# EAGLE design MainPCB (EAGLE 9.2.0)
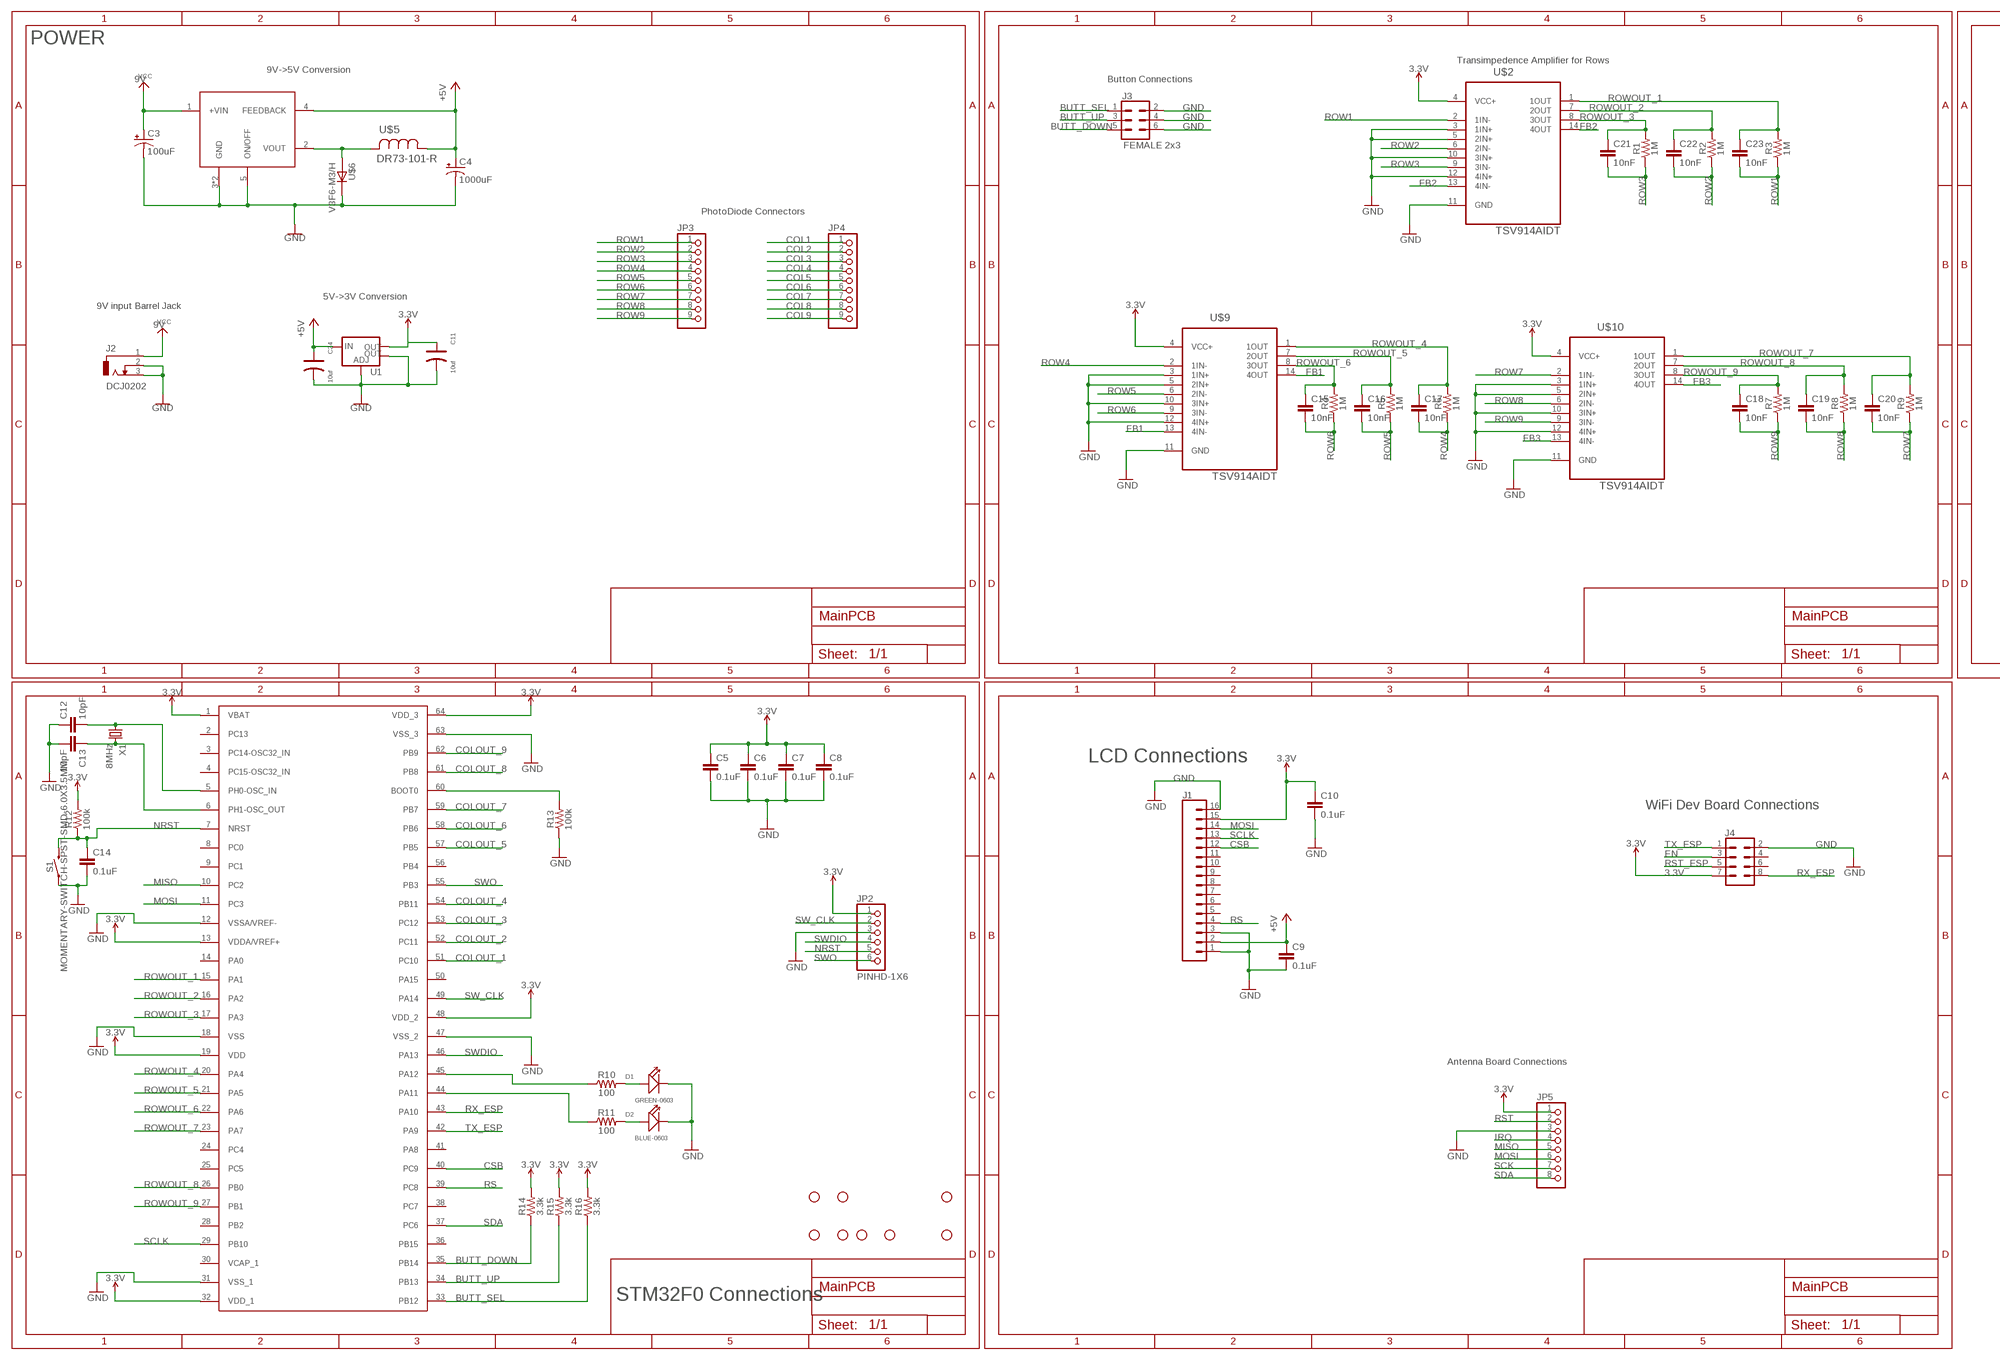
[diagram p0: schematic, sheet 1, part 1 of 2]
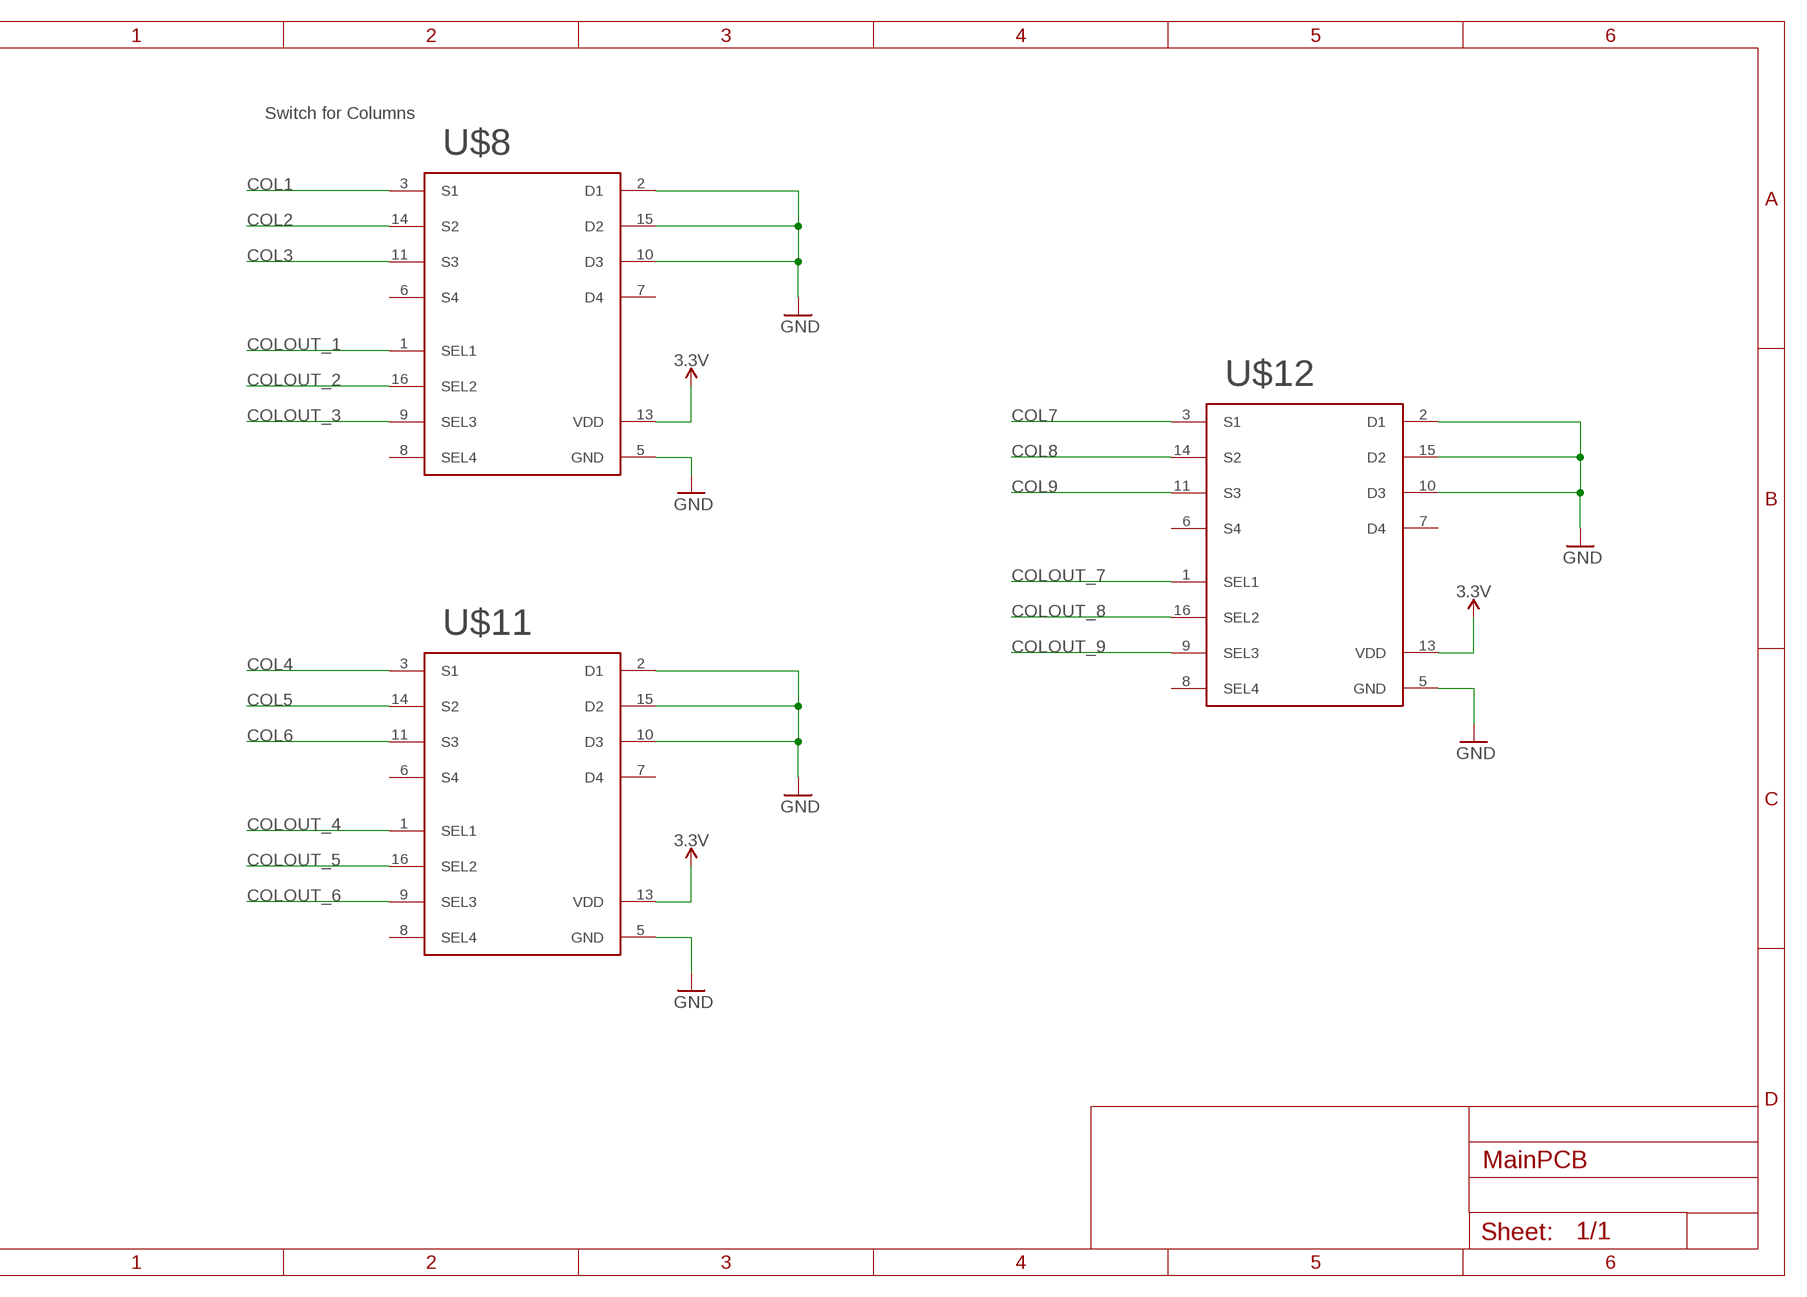
[diagram p1: schematic, sheet 1, part 2 of 2]

## Parts
C3  100uF  100UF-POLAR-25V-20%(ELEC)  [PANASONIC_D]
C4  1000uF  100UF-POLAR-25V-20%(ELEC)  [PANASONIC_D]
C5  0.1uF  0.1UF-0603-100V-10%  [0603]
C6  0.1uF  0.1UF-0603-100V-10%  [0603]
C7  0.1uF  0.1UF-0603-100V-10%  [0603]
C8  0.1uF  0.1UF-0603-100V-10%  [0603]
C9  0.1uF  0.1UF-0603-100V-10%  [0603]
C10  0.1uF  0.1UF-0603-100V-10%  [0603]
C11  10uf  TANTALUM-SMD-10UF-10V-10%(AVX-A)  [AVX-A]
C12  10pF  10UF-0805-10V-10%  [0805]
C13  10pF  10UF-0805-10V-10%  [0805]
C14  0.1uF  0.1UF-0603-25V-(+80/-20%)  [0603]
C15  10nF  10NF-0603-50V-10%  [0603]
C16  10nF  10NF-0603-50V-10%  [0603]
C17  10nF  10NF-0603-50V-10%  [0603]
C18  10nF  10NF-0603-50V-10%  [0603]
C19  10nF  10NF-0603-50V-10%  [0603]
C20  10nF  10NF-0603-50V-10%  [0603]
C21  10nF  10NF-0603-50V-10%  [0603]
C22  10nF  10NF-0603-50V-10%  [0603]
C23  10nF  10NF-0603-50V-10%  [0603]
C24  10uf  TANTALUM-SMD-10UF-10V-10%(AVX-A)  [AVX-A]
D1  GREEN-0603  SMD-LED-CLEAR-GREEN(0603)  [LED-0603]
D2  BLUE-0603  SMD-LED-CLEAR-BLUE(0603)  [LED-0603]
H2  STAND-OFF  [STAND-OFF]
H3  STAND-OFF  [STAND-OFF]
H4  STAND-OFF  [STAND-OFF]
H6  STAND-OFF  [STAND-OFF]
H7  STAND-OFF  [STAND-OFF]
H8  STAND-OFF  [STAND-OFF]
H9  STAND-OFF  [STAND-OFF]
H10  STAND-OFF  [STAND-OFF]
J1  CONN_161X16_NO_SILK  [1X16_NO_SILK]
J2  DCJ0202  [DCJ0202]
J3  FEMALE 2x3  CONN_03X2FEMALE  [2X3]
J4  CONN_04X2  [2X4]
JP2  PINHD-1X6  [1X06]
JP3  PINHD-1X9  [1X09]
JP4  PINHD-1X9  [1X09]
JP5  PINHD-1X8  [1X08]
R1  1M  1KOHM-0603-1/10W-1%  [0603]
R2  1M  1KOHM-0603-1/10W-1%  [0603]
R3  1M  1KOHM-0603-1/10W-1%  [0603]
R4  1M  1KOHM-0603-1/10W-1%  [0603]
R5  1M  1KOHM-0603-1/10W-1%  [0603]
R6  1M  1KOHM-0603-1/10W-1%  [0603]
R7  1M  1KOHM-0603-1/10W-1%  [0603]
R8  1M  1KOHM-0603-1/10W-1%  [0603]
R9  1M  1KOHM-0603-1/10W-1%  [0603]
R10  100  100OHM-0603-1/4W-5%  [0603]
R11  100  100OHM-0603-1/4W-5%  [0603]
R12  100k  100KOHM-0603-1/10W-1%  [0603]
R13  100k  100KOHM-0603-1/10W-1%  [0603]
R14  3.3k  3.3KOHM-0603-1/10W-1%  [0603]
R15  3.3k  3.3KOHM-0603-1/10W-1%  [0603]
R16  3.3k  3.3KOHM-0603-1/10W-1%  [0603]
S1  MOMENTARY-SWITCH-SPST-SMD-6.0X3.5MM  [TACTILE_SWITCH_SMD_6.0X3.5MM]
U1  V_REG_LM1117SOT223  [SOT223]
U$1  STM32F410R8T6  [TQFP64]
U$2  TSV914AIDT  [SOIC-14]
U$3  LM2576  [DDPAK/TO-263-5]
U$5  DR73-101-R  [INDUCTOR_NONSTANDARD]
U$6  V3F6-M3/H  [DO-219AB]
U$8  TMUX1112PWR  [16-TSSOP]
U$9  TSV914AIDT  [SOIC-14]
U$10  TSV914AIDT  [SOIC-14]
U$11  TMUX1112PWR  [16-TSSOP]
U$12  TMUX1112PWR  [16-TSSOP]
X1  8MHz  CRYSTALS-NOGND-HC49  [HC49]

## Nets
3.3V: C5.1 C6.1 C7.1 C8.1 C10.1 C11.+ J1.15 J4.7 JP2.1 JP5.1 R12.2 R14.2 R15.2 R16.2 U1.2(OUT) U$1.1(VBAT) U$1.13(VDDA/VREF+) U$1.19(VDD) U$1.32(VDD_1) U$1.48(VDD_2) U$1.64(VDD_3) U$2.4(VCC+) U$8.13(VDD) U$9.4(VCC+) U$10.4(VCC+) U$11.13(VDD) U$12.13(VDD)
9V: C3.+ J2.1 U$3.1(+VIN) ; supply symbol labelled VCC
+5V: C4.+ C9.1 C24.+ J1.2 U1.3(IN) U$3.4(FEEDBACK) U$5.1
BUTT_DOWN: J3.5 R14.1 U$1.35(PB14)
BUTT_SEL: J3.1 R16.1 U$1.33(PB12)
BUTT_UP: J3.3 R15.1 U$1.34(PB13)
COL1: JP4.1 U$8.3(S1)
COL2: JP4.2 U$8.14(S2)
COL3: JP4.3 U$8.11(S3)
COL4: JP4.4 U$11.3(S1)
COL5: JP4.5 U$11.14(S2)
COL6: JP4.6 U$11.11(S3)
COL7: JP4.7 U$12.3(S1)
COL8: JP4.8 U$12.14(S2)
COL9: JP4.9 U$12.11(S3)
COLOUT_1: U$1.51(PC10) U$8.1(SEL1)
COLOUT_2: U$1.52(PC11) U$8.16(SEL2)
COLOUT_3: U$1.53(PC12) U$8.9(SEL3)
COLOUT_4: U$1.54(PB11) U$11.1(SEL1)
COLOUT_5: U$1.57(PB5) U$11.16(SEL2)
COLOUT_6: U$1.58(PB6) U$11.9(SEL3)
COLOUT_7: U$1.59(PB7) U$12.1(SEL1)
COLOUT_8: U$1.61(PB8) U$12.16(SEL2)
COLOUT_9: U$1.62(PB9) U$12.9(SEL3)
CSB: J1.12 U$1.40(PC9)
EN: J4.3
FB1: U$9.13(4IN-) U$9.14(4OUT)
FB2: U$2.13(4IN-) U$2.14(4OUT)
FB3: U$10.13(4IN-) U$10.14(4OUT)
GND: C3.- C4.- C5.2 C6.2 C7.2 C8.2 C9.2 C10.2 C11.- C12.1 C13.2 C14.2 C24.- D1.- D2.- J1.1 J1.3 J1.16 J2.2 J2.3 J3.2 J3.4 J3.6 J4.2 JP2.3 JP5.3 R13.1 S1.1 U1.1(ADJ) U1.4(OUT) U$1.12(VSSA/VREF-) U$1.18(VSS) U$1.31(VSS_1) U$1.47(VSS_2) U$1.63(VSS_3) U$2.3(1IN+) U$2.5(2IN+) U$2.10(3IN+) U$2.11(GND) U$2.12(4IN+) U$3.3(GND) U$3.5(ON/OFF) U$3.6(GND) U$6.C U$8.2(D1) U$8.5(GND) U$8.10(D3) U$8.15(D2) U$9.3(1IN+) U$9.5(2IN+) U$9.10(3IN+) U$9.11(GND) U$9.12(4IN+) U$10.3(1IN+) U$10.5(2IN+) U$10.10(3IN+) U$10.11(GND) U$10.12(4IN+) U$11.2(D1) U$11.5(GND) U$11.10(D3) U$11.15(D2) U$12.2(D1) U$12.5(GND) U$12.10(D3) U$12.15(D2)
IRQ: JP5.4
MISO: JP5.5 U$1.10(PC2)
MOSI: J1.14 JP5.6 U$1.11(PC3)
N$1: C12.2 U$1.5(PH0-OSC_IN) X1.1
N$2: C13.1 U$1.6(PH1-OSC_OUT) X1.2
N$3: U$3.2(VOUT) U$5.2 U$6.A
N$4: R10.1 U$1.45(PA12)
N$5: D1.+ R10.2
N$6: R11.1 U$1.44(PA11)
N$7: D2.+ R11.2
N$9: R13.2 U$1.60(BOOT0)
NRST: C14.1 JP2.5 R12.1 S1.2 U$1.7(NRST)
ROW1: C23.2 JP3.1 R3.1 U$2.2(1IN-)
ROW2: C22.2 JP3.2 R2.1 U$2.6(2IN-)
ROW3: C21.2 JP3.3 R1.1 U$2.9(3IN-)
ROW4: C17.2 JP3.4 R6.1 U$9.2(1IN-)
ROW5: C16.2 JP3.5 R5.1 U$9.6(2IN-)
ROW6: C15.2 JP3.6 R4.1 U$9.9(3IN-)
ROW7: C20.2 JP3.7 R9.1 U$10.2(1IN-)
ROW8: C19.2 JP3.8 R8.1 U$10.6(2IN-)
ROW9: C18.2 JP3.9 R7.1 U$10.9(3IN-)
ROWOUT_1: C23.1 R3.2 U$1.15(PA1) U$2.1(1OUT)
ROWOUT_2: C22.1 R2.2 U$1.16(PA2) U$2.7(2OUT)
ROWOUT_3: C21.1 R1.2 U$1.17(PA3) U$2.8(3OUT)
ROWOUT_4: C17.1 R6.2 U$1.20(PA4) U$9.1(1OUT)
ROWOUT_5: C16.1 R5.2 U$1.21(PA5) U$9.7(2OUT)
ROWOUT_6: C15.1 R4.2 U$1.22(PA6) U$9.8(3OUT)
ROWOUT_7: C20.1 R9.2 U$1.23(PA7) U$10.1(1OUT)
ROWOUT_8: C19.1 R8.2 U$1.26(PB0) U$10.7(2OUT)
ROWOUT_9: C18.1 R7.2 U$1.27(PB1) U$10.8(3OUT)
RS: J1.4 U$1.39(PC8)
RST: JP5.2
RST_ESP: J4.5
RX_ESP: J4.8 U$1.43(PA10)
SCK: JP5.7
SCLK: J1.13 U$1.29(PB10)
SDA: JP5.8 U$1.37(PC6)
SW_CLK: JP2.2 U$1.49(PA14)
SWDIO: JP2.4 U$1.46(PA13)
SWO: JP2.6 U$1.55(PB3)
TX_ESP: J4.1 U$1.42(PA9)
Unconnected: J1.5 J1.6 J1.7 J1.8 J1.9 J1.10 J1.11 J4.4 J4.6 U$1.2(PC13) U$1.3(PC14-OSC32_IN) U$1.4(PC15-OSC32_IN) U$1.8(PC0) U$1.9(PC1) U$1.14(PA0) U$1.24(PC4) U$1.25(PC5) U$1.28(PB2) U$1.30(VCAP_1) U$1.36(PB15) U$1.38(PC7) U$1.41(PA8) U$1.50(PA15) U$1.56(PB4) U$8.6(S4) U$8.7(D4) U$8.8(SEL4) U$11.6(S4) U$11.7(D4) U$11.8(SEL4) U$12.6(S4) U$12.7(D4) U$12.8(SEL4)

## Notes on the sheet
- POWER
- Transimpedence Amplifier for Rows | Switch for Columns
- 9V->5V Conversion
- Button Connections
- PhotoDiode Connectors
- 5V->3V Conversion
- 9V input Barrel Jack
- LCD Connections
- WiFi Dev Board Connections
- Antenna Board Connections
- STM32F0 Connections

## Library data of the parts
C3 = SparkFun-Capacitors:100UF-POLAR: 100µF polarized capacitors A capacitor is a passive two-terminal electrical component used to store electrical energy temporarily in an electric field.; PROD_ID: CAP-12547
C4 = SparkFun-Capacitors:100UF-POLAR: 100µF polarized capacitors A capacitor is a passive two-terminal electrical component used to store electrical energy temporarily in an electric field.; PROD_ID: CAP-12547; VALUE: 100uF
C5-C10 = SparkFun-Capacitors:0.1UF: 0.1µF ceramic capacitors A capacitor is a passive two-terminal electrical component used to store electrical energy temporarily in an electric field.; PROD_ID: CAP-08390
C11 C24 = Seeed-Capacitor:TANTALUM-SMD-10UF-10V-10%(AVX-A): 302020011; MPN: TAJA106K010RNJ
C12 C13 = SparkFun-Capacitors:10UF: 10.0µF ceramic capacitors A capacitor is a passive two-terminal electrical component used to store electrical energy temporarily in an electric field.; PROD_ID: CAP-11330; VALUE: 10uF
C14 = SparkFun-Capacitors:0.1UF: 0.1µF ceramic capacitors A capacitor is a passive two-terminal electrical component used to store electrical energy temporarily in an electric field.; PROD_ID: CAP-00810
C15-C23 = SparkFun-Capacitors:10NF: 0.01uF/10nF/10,000pF ceramic capacitors A capacitor is a passive two-terminal electrical component used to store electrical energy temporarily in an electric field. CAP-09321; PROD_ID: CAP-00867
D1 = Seeed-LED:SMD-LED-CLEAR-GREEN(0603): 304090043; MPN: 19-217-G7C-AN1P2-3T
D2 = Seeed-LED:SMD-LED-CLEAR-BLUE(0603): 304090045; MPN: 19-217-BHC-ZL1M2RY-3T
H2-H4 H6-H10 = SparkFun-Hardware:STAND-OFF: Stand Off Drill holes for mechanically mounting via screws, standoffs, etc. Note: Use the keepout ring to avoid running the screw head into surrounding components. Variant Overviews STAND-OFF - Mechanical footprint for a #4 phillips button head screw. STAND-OFF-TIGHT - Mechanical footprint for a #4 phillips button head screw, Example SparkFun Products Screw - Phillips Head (1/4", 4-40, 10 pack) (PRT-10453) Screw - Phillips Head (1/2", 4-40, 10 pack) (PRT-10452) Screw - Phillips Head (3/4", 4-40, 10 pack) (PRT-10451) Screw - Phillips Head (1", 4-40, 10 pack) (PRT-10450)
J1 = SparkFun-Connectors:CONN_16: Multi connection point. Often used as Generic Header-pin footprint for 0.1 inch spaced/style header connections On any of the 0.1 inch spaced packages, you can populate with these: Break Away Headers - Straight (PRT-00116) Break Away Male Headers - Right Angle (PRT-00553) Female Headers (PRT-00115) Break Away Headers - Machine Pin (PRT-00117) Break Away Female Headers - Swiss Machine Pin (PRT-00743) For SCREWTERMINALS and SPRING TERMINALS visit here: Screw Terimnals on SparkFun.com (5mm/3.5mm/2.54mm spacing) This device is also useful as a general connection point to wire up your design to another part of your project. Our various solder wires solder well into these plated through hole pads. Hook-Up Wire - Assortment (Stranded, 22 AWG) (PRT-11375) Hook-Up Wire - Assortment (Solid Core, 22 AWG) (PRT-11367) View the entire wire category on our website here Special notes: Molex polarized connector foot print use with SKU : PRT-08231 with associated crimp pins and housings. 1MM SMD Version SKU: PRT-10208 NOTES ON THE VARIANTS LOCK and LOCK_LONGPADS... This footprint was designed to help hold the alignment of a through-hole component (i.e. 6-pin header) while soldering it into place. You may notice that each hole has been shifted either up or down by 0.005 of an inch from it's more standard position (which is a perfectly straight line). This slight alteration caused the pins (the squares in the middle) to touch the edges of the holes. Because they are alternating, it causes a "brace" to hold the component in place. 0.005 has proven to be the perfect amount of "off-center" position when using our standard breakaway headers. Although looks a little odd when you look at the bare footprint, once you have a header in there, the alteration is very hard to notice. Also,if you push a header all the way into place, it is covered up entirely on the bottom side.
J2 = con-jack:DCJ0202: DC POWER JACK Source: DCJ0202.pdf; OC_FARNELL: unknown; OC_NEWARK: unknown
J3 = SparkFun-Connectors:CONN_03X2: Multi connection point. Often used as Generic Header-pin footprint for 0.1 inch spaced/style header connections You can populate with any combo of single row headers, but if you'd like an exact match, check these: Header - 2x3 (Male, 0.1") (PRT-12807) Header - 2x3 (Female, 0.1") (PRT-13010) 2x3 Pin Shrouded Header (PRT-10877) On any of the 0.1 inch spaced packages, you can populate with these: Break Away Headers - Straight (PRT-00116) Break Away Male Headers - Right Angle (PRT-00553) Female Headers (PRT-00115) Break Away Headers - Machine Pin (PRT-00117) Break Away Female Headers - Swiss Machine Pin (PRT-00743) Special note: the shrouded connector mates well with our 3x2 ribbon cables: Ribbon Crimp Connector - 6-pin (2x3, Female) (PRT-10651) Ribbon Cable - 6 wire (15ft) (PRT-10646); PROD_ID: CONN-11566
J4 = SparkFun-Connectors:CONN_04X2: Multi connection point. Often used as Generic Header-pin footprint for 0.1 inch spaced/style header connections On any of the 0.1 inch spaced packages, you can populate with these: Break Away Headers - Straight (PRT-00116) Break Away Male Headers - Right Angle (PRT-00553) Female Headers (PRT-00115) Break Away Headers - Machine Pin (PRT-00117) Break Away Female Headers - Swiss Machine Pin (PRT-00743)
JP2 = audio amplifier example:PINHD-1X6: PIN HEADER
JP3 JP4 = pinhead:PINHD-1X9: PIN HEADER
JP5 = pinhead:PINHD-1X8: PIN HEADER
R1-R9 = SparkFun-Resistors:1KOHM: 1kΩ resistor A resistor is a passive two-terminal electrical component that implements electrical resistance as a circuit element. Resistors act to reduce current flow, and, at the same time, act to lower voltage levels within circuits. - Wikipedia; PROD_ID: RES-07856; VALUE: 1k
R10 R11 = SparkFun-Resistors:100OHM: 100Ω resistor A resistor is a passive two-terminal electrical component that implements electrical resistance as a circuit element. Resistors act to reduce current flow, and, at the same time, act to lower voltage levels within circuits. - Wikipedia; PROD_ID: RES-12438
R12 R13 = SparkFun-Resistors:100KOHM: 100kΩ resistor A resistor is a passive two-terminal electrical component that implements electrical resistance as a circuit element. Resistors act to reduce current flow, and, at the same time, act to lower voltage levels within circuits. - Wikipedia; PROD_ID: RES-07828
R14-R16 = SparkFun-Resistors:3.3KOHM: 3.3kΩ resistor A resistor is a passive two-terminal electrical component that implements electrical resistance as a circuit element. Resistors act to reduce current flow, and, at the same time, act to lower voltage levels within circuits. - Wikipedia; PROD_ID: RES-07851
S1 = SparkFun-Switches:MOMENTARY-SWITCH-SPST: Momentary Switch (Pushbutton) - SPST Normally-open (NO) SPST momentary switches (buttons, pushbuttons). Variants PTH-12MM - 12mm square, through-hole Momentary Pushbutton Switch - 12mm Square (COM-09190) PTH-6.0MM, PTH-6.0MM-KIT - 6.0mm square, through-hole Mini Pushbutton Switch (COM-00097) KIT package intended for soldering kit's - only one side of pads' copper is exposed. PTH-RIGHT-ANGLE-KIT - Right-angle, through-hole Right Angle Tactile Button - Used on SparkFun BigTime Watch Kit SMD-12MM - 12mm square, surface-mount Tactile Button - SMD (12mm) (COM-12993) Used on SparkFun PicoBoard SMD-4.5MM - 4.5mm Square Trackball Switch Used on SparkFun Blackberry Trackballer Breakout SMD-4.6MMX2.8MM - 4.60mm x 2.80mm, surface mount Used on SparkFun SAMD21 Mini Breakout SMD-5.2MM, SMD-5.2-REDUNDANT - 5.2mm square, surface-mount Mini Pushbutton Switch - SMD (COM-08720) Used on Arduino Pro Mini REDUNDANT package connects both switch circuits together SMD-6.0X3.5MM - 6.0 x 3.5mm, surface mount Momentary Reset Switch SMD (COM-08229) SMD-6.2MM-TALL - 6.2mm square, surface mount Tactile Button - SMD (6mm) Used on SparkFun Digital Sandbox SMD-RIGHT-ANGLE - Right-angle, surface mount Used on SparkFun Block for Intel® Edison - Arduino; PROD_ID: SWCH-00815; SF_SKU: COM-08229
U1 = SparkFun-IC-Power:V_REG_LM1117: Voltage Regulator LM1117 Standard adjustable voltage regulator but in SMD form. Spark Fun Electronics SKU : COM-00595; PROD_ID: VREG-08170
U$1 = SeniorDesignParts:STM32F410R8T6
U$2 U$9 U$10 = SeniorDesignParts:TSV914AIDT
U$3 = SeniorDesignParts:LM2576
U$5 = SeniorDesignParts:DR73-101-R
U$6 = SeniorDesignParts:V3F6-M3/H
U$8 U$11 U$12 = SeniorDesignParts:TMUX1112PWR
X1 = IQD-Frequency-Products:CRYSTALS-NOGND: CRYSTALS CAN NOT GROUNDED

## Board
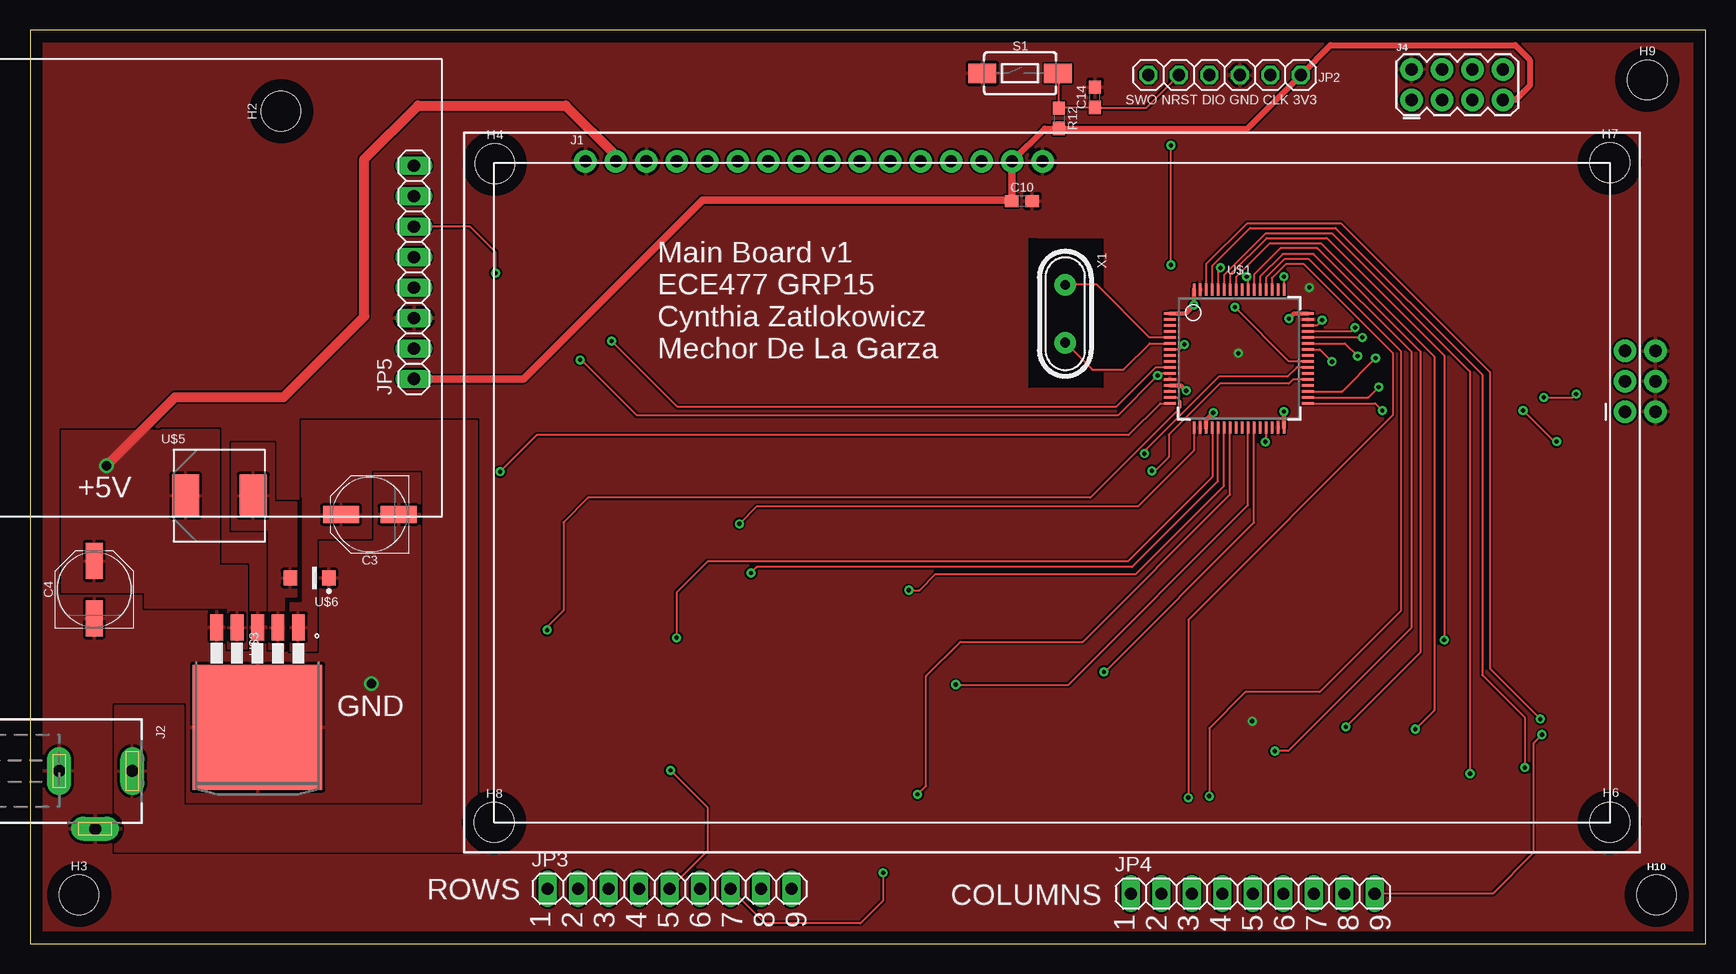
[diagram p2: board, top side]
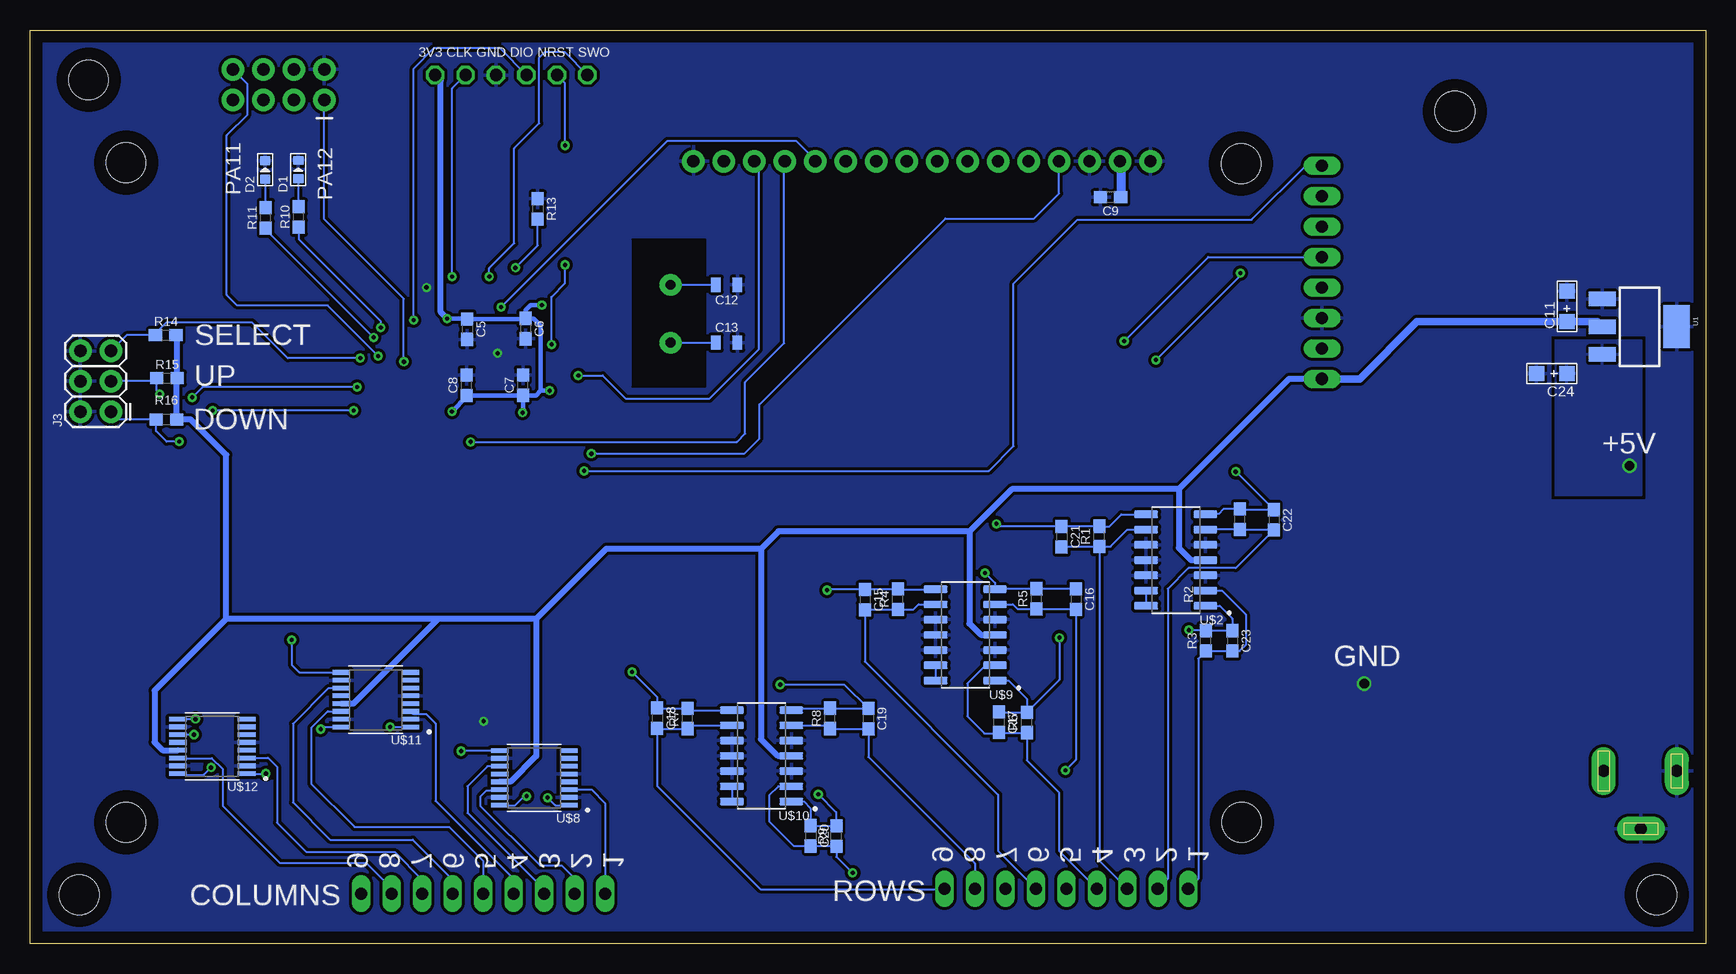
[diagram p3: board, bottom side, seen from below]

Size 139.7 x 76.2 mm. Coordinates in mm from the lower left corner, seen from the top.
Outline: 0,0 139.7,0 139.7,76.2 0,76.2 0,0
Copper layers (1*16): Top 0.035mm / dielectric 1.5mm / Bottom 0.035mm
Design rules "default": minimum track width 6mil, minimum drill 0.35mm, track to track 6mil, track to pad 6mil, pad to pad 6mil, via to via 6mil, smd to smd 6mil, copper to edge 40mil, drill to drill 6mil, minimum pad ring 10mil, minimum via ring 8mil, stop-mask expansion 4mil, vias tented up to drill 0mil, thermal gap 10mil

### Footprints (pad centres in the part's own frame; a part is rotated, then mirrored left to right if it is on the bottom)
PANASONIC_D = smd 3 x 1.4: + 2.4,0; - -2.4,0
0603 = smd 1.1 x 1: 1 -0.85,0; 2 0.85,0
AVX-A = smd 1.27 x 1.27: + -1.27,0; - 1.27,0
0805 = smd 0.8 x 1.2: 1 -0.9,0; 2 0.9,0
LED-0603 = smd 0.762 x 0.889: + -0.762,0; - 0.762,0
STAND-OFF = hole 3.302: 0,0
1X16_NO_SILK = drill 1.016 pad 1.88: 1 0,0; 2 2.54,0; 3 5.08,0; 4 7.62,0; 5 10.16,0; 6 12.7,0; 7 15.24,0; 8 17.78,0; 9 20.32,0; 10 22.86,0; 11 25.4,0; 12 27.94,0; 13 30.48,0; 14 33.02,0; 15 35.56,0; 16 38.1,0
DCJ0202 = drill 1 pad 2 long: 1 0,3.1; 2 4.8,0; 3 0,-3
2X3 = drill 1.016 pad 1.88: 1 0,0; 2 0,2.54; 3 2.54,0; 4 2.54,2.54; 5 5.08,0; 6 5.08,2.54
2X4 = drill 1.016 pad 1.88: 1 -3.81,-1.27; 2 -3.81,1.27; 3 -1.27,-1.27; 4 -1.27,1.27; 5 1.27,-1.27; 6 1.27,1.27; 7 3.81,-1.27; 8 3.81,1.27
1X06 = drill 1.016 octagon: 1 -6.35,0; 2 -3.81,0; 3 -1.27,0; 4 1.27,0; 5 3.81,0; 6 6.35,0
1X09 = drill 1.016 long: 1 -10.16,0; 2 -7.62,0; 3 -5.08,0; 4 -2.54,0; 5 0,0; 6 2.54,0; 7 5.08,0; 8 7.62,0; 9 10.16,0
1X08 = drill 1.016 long: 1 -8.89,0; 2 -6.35,0; 3 -3.81,0; 4 -1.27,0; 5 1.27,0; 6 3.81,0; 7 6.35,0; 8 8.89,0
TACTILE_SWITCH_SMD_6.0X3.5MM = smd 2.3 x 1.6: 1 -3.15,0; 2 3.15,0
SOT223 = smd 1.219 x 2.235: 1 -2.311,-3.099; 2 0,-3.099; 3 2.311,-3.099 | smd 3.6 x 2.2: 4 0,3.099
TQFP64 = smd 0.22 x 1: 1 -3.75,-5.75; 2 -3.25,-5.75; 3 -2.75,-5.75; 4 -2.25,-5.75; 5 -1.75,-5.75; 6 -1.25,-5.75; 7 -0.75,-5.75; 8 -0.25,-5.75; 9 0.25,-5.75; 10 0.75,-5.75; 11 1.25,-5.75; 12 1.75,-5.75; 13 2.25,-5.75; 14 2.75,-5.75; 15 3.25,-5.75; 16 3.75,-5.75; 33 3.75,5.75; 34 3.25,5.75; 35 2.75,5.75; 36 2.25,5.75; 37 1.75,5.75; 38 1.25,5.75; 39 0.75,5.75; 40 0.25,5.75; 41 -0.25,5.75; 42 -0.75,5.75; 43 -1.25,5.75; 44 -1.75,5.75; 45 -2.25,5.75; 46 -2.75,5.75; 47 -3.25,5.75; 48 -3.75,5.75 | smd 1 x 0.22: 17 5.75,-3.75; 18 5.75,-3.25; 19 5.75,-2.75; 20 5.75,-2.25; 21 5.75,-1.75; 22 5.75,-1.25; 23 5.75,-0.75; 24 5.75,-0.25; 25 5.75,0.25; 26 5.75,0.75; 27 5.75,1.25; 28 5.75,1.75; 29 5.75,2.25; 30 5.75,2.75; 31 5.75,3.25; 32 5.75,3.75; 49 -5.75,3.75; 50 -5.75,3.25; 51 -5.75,2.75; 52 -5.75,2.25; 53 -5.75,1.75; 54 -5.75,1.25; 55 -5.75,0.75; 56 -5.75,0.25; 57 -5.75,-0.25; 58 -5.75,-0.75; 59 -5.75,-1.25; 60 -5.75,-1.75; 61 -5.75,-2.25; 62 -5.75,-2.75; 63 -5.75,-3.25; 64 -5.75,-3.75
SOIC-14 = smd 1.97 x 0.6: 1 -2.475,3.81; 2 -2.475,2.54; 3 -2.475,1.27; 4 -2.475,0; 5 -2.475,-1.27; 6 -2.475,-2.54; 7 -2.475,-3.81; 8 2.475,-3.81; 9 2.475,-2.54; 10 2.475,-1.27; 11 2.475,0; 12 2.475,1.27; 13 2.475,2.54; 14 2.475,3.81
DDPAK/TO-263-5 = smd 2.159 x 1.067: 1 0.559,8.484; 2 0.559,6.782; 3 0.559,5.08; 4 0.559,3.378; 5 0.559,1.676 | smd 10.41 x 10.8: 6 8.89,5.08
INDUCTOR_NONSTANDARD = smd 2.261 x 3.505: 1 -2.819,0; 2 2.819,0
DO-219AB = smd 1.12 x 1.22: A 1.6,0; C -1.6,0
16-TSSOP = smd 1.57 x 0.41: 1 -2.87,2.275; 2 -2.87,1.625; 3 -2.87,0.975; 4 -2.87,0.325; 5 -2.87,-0.325; 6 -2.87,-0.975; 7 -2.87,-1.625; 8 -2.87,-2.275; 9 2.87,-2.275; 10 2.87,-1.625; 11 2.87,-0.975; 12 2.87,-0.325; 13 2.87,0.325; 14 2.87,0.975; 15 2.87,1.625; 16 2.87,2.275
HC49 = drill 0.813 pad 1.8: 1 -2.413,0; 2 2.413,0

### Placement (x,y rotation side)
C3  28.32,35.81 180 top
C4  5.35,29.55 90 top
C5  103.25,51.25 270 bottom
C6  98.4,51.3 270 bottom
C7  98.6,46.59 90 bottom
C8  103.3,46.58 90 bottom
C9  49.63,62.25 180 bottom
C10  82.69,61.94 0 top
C11  11.58,53.16 90 bottom
C12  81.63,54.96 180 bottom
C13  81.63,50.14 0 bottom
C14  88.78,70.59 90 top
C15  70.11,28.69 270 bottom
C16  52.52,28.75 270 bottom
C17  58.95,18.5 270 bottom
C18  87.41,18.82 270 bottom
C19  69.82,18.78 270 bottom
C20  74.63,9.01 270 bottom
C21  53.71,33.95 270 bottom
C22  36.03,35.35 270 bottom
C23  39.48,25.27 270 bottom
C24  12.85,47.55 180 bottom
D1  117.34,64.56 90 bottom
D2  120.1,64.54 90 bottom
H2  20.92,69.42 90 top
H3  4.09,4.09 0 top
H4  38.74,65.05 0 top
H6  131.7,10.13 0 top
H7  131.7,65.13 0 top
H8  38.7,10.13 0 top
H9  134.82,72.03 0 top
H10  135.59,4.09 0 top
J1  46.3,65.25 0 top
J2  5.42,14.41 270 top
J3  132.96,44.37 90 bottom
J4  118.97,71.64 0 top
JP2  99.59,72.45 180 top
JP3  53.31,4.6 0 top
JP4  101.93,4.19 0 top
JP5  32,56 90 top
R1  50.57,33.98 90 bottom
R2  38.84,35.41 90 bottom
R3  41.69,25.27 90 bottom
R4  67.35,28.74 90 bottom
R5  55.79,28.77 90 bottom
R6  56.61,18.46 90 bottom
R7  84.88,18.8 90 bottom
R8  73,18.8 90 bottom
R9  72.48,8.99 90 bottom
R10  117.29,60.61 90 bottom
R11  120.04,60.54 90 bottom
R12  85.77,68.84 270 top
R13  97.38,61.28 270 bottom
R14  128.38,50.75 0 bottom
R15  128.28,47.17 0 bottom
R16  128.33,43.73 0 bottom
S1  82.54,72.58 0 top
U1  5.54,51.46 270 bottom
U$1  100.78,48.82 270 top
U$2  44.19,32 180 bottom
U$3  13.89,26.95 270 top
U$5  15.78,37.38 0 top
U$6  23.3,30.51 180 top
U$8  97.67,13.84 180 bottom
U$9  61.73,25.77 180 bottom
U$10  78.71,15.68 180 bottom
U$11  110.87,20.36 180 bottom
U$12  124.51,16.48 180 bottom
X1  86.3,52.54 270 top

### Tracks (layer width: path | path; a pad name or v marks a point on that pad's centre or on a via)
3.3V  (via drill 0.35)
  Top 0.381: v98.63,44.29 98.02,43.68 U$1.19 | v104.53,44.39 U$1.32 | U$1.48 105.36,52.57 v104.93,52.14 | U$1.64 v97.03,53.26 96.35,52.57 U$1.1 | v96.38,46.12 95.94,46.57 U$1.13
  Top 0.508: J1.15 84.6,67.99 R12.2 101.47,67.99 JP2.1 108.42,74.93 123.8,74.93 125.02,73.71 125.02,71.55 123.84,70.37 J4.7
  Top 0.61: JP5.1 41.14,47.11 56.06,62.03 81.75,62.03 | C10.1 81.84,65.23
  Top 0.813: 81.75,62.03 C10.1 | 81.84,65.23 J1.15
  Bottom 0.381: C6.1 97.73,52.15 97.13,51.56 97.13,46.12 | C7.1 97.52,45.74 97.13,46.12 | C7.1 C8.1 103.3,45.63 104.53,44.4 v104.53,44.39 | C7.1 98.6,44.33 v98.63,44.29 | v97.03,53.26 97.97,53.26 98.4,52.83 C6.1 | C6.1 98.45,52.1 C5.1 103.29,52.14 v104.93,52.14 | 97.13,46.12 v96.39,46.12 v96.38,46.12
  Bottom 0.508: v104.93,52.14 105.47,52.67 105.47,71.98 JP2.1 | JP5.1 34.75,47.11 43.94,37.92 | 43.94,37.92 43.94,33.02 42.92,32 U$2.4 | 43.94,37.92 57.86,37.92 61.39,34.39 | 61.39,34.39 61.39,26.72 60.44,25.77 U$9.4 | 61.39,34.39 77.32,34.39 78.77,32.94 | 78.77,32.94 78.77,17.07 77.38,15.68 U$10.4 | 78.77,32.94 91.67,32.94 97.51,27.1 | 97.51,27.1 97.51,15.66 99.65,13.52 U$8.13 | U$11.13 113.72,20.02 112.75,20.02 105.66,27.1 | 97.51,27.1 105.66,27.1 | 105.66,27.1 123.34,27.1 | U$12.13 128.65,16.15 129.31,16.82 129.31,21.13 123.34,27.1 | 123.34,27.1 123.34,40.77 126.31,43.73 R16.2 127.48,47.12 R15.2 127.43,50.65 R14.2
  Bottom 0.61: U1.2 9.07,51.89 C11.+ 24.08,51.89 28.86,47.11 JP5.1
9V
  pour Top (isolate 0.406, rank 2): 7.06,19.84 7.06,7.7 37.29,7.7 37.29,43.58 22.63,43.58 22.63,28.49 21.5,28.49 21.5,24.49 23.88,24.49 23.88,33.83 28.42,33.83 28.42,39.54 32.76,39.54 32.76,11.5 12.8,11.5 12.8,19.84
+5V  (via drill 0.8)
  Top 0.813: v6.38,39.88 12.09,45.59 21.13,45.59 27.86,52.32 27.86,65.43 32.33,69.9 44.65,69.9 48.84,65.71 J1.2
  Bottom 0.762: C9.1 48.78,65.19 J1.2
  pour Top: 11.02,42.9 15.72,42.9 15.72,31.55 18.06,31.55 18.06,24.59 16.54,24.59 16.54,28.02 9.6,28.02 9.6,29.29 2.69,29.29 2.69,42.82 11.02,42.82
  pour Bottom: 6.38,50.32 12.57,50.32 12.57,45.36 12.57,37.41 5.36,37.41 5.36,50.32
BUTT_DOWN  (via drill 0.35)
  Top 0.152: U$1.35 109.39,46.07 v112.17,48.84
  Bottom 0.152: v112.17,48.84 118.21,48.84 121.18,51.82 128.34,51.82 129.23,50.93 R14.1 131.66,50.75 J3.5
BUTT_SEL  (via drill 0.35)
  Top 0.152: U$1.33 112.13,45.07 v112.72,44.48 | v124.46,44.48 127.05,41.88 v127.25,41.88
  Bottom 0.152: J3.1 132.32,43.73 R16.1 129.18,42.75 128.32,41.88 v127.25,41.88 | v112.72,44.48 v124.46,44.48
BUTT_UP  (via drill 0.35)
  Top 0.152: U$1.34 111.56,45.57 v112.42,46.43 | v126.19,45.57 128.6,45.57 v128.88,45.85
  Bottom 0.152: J3.3 129.39,46.91 R15.1 129.13,46.1 v128.88,45.85 | v112.42,46.43 125.32,46.43 v126.19,45.57
COL1
  Bottom 0.152: U$8.3 92.9,12.87 91.77,11.73 JP4.1
COL2
  Bottom 0.152: U$8.14 100.61,12.79 101.64,12.79 102.16,12.27 102.16,11.53 97.18,6.55 95.38,6.55 94.31,5.49 JP4.2
COL3
  Bottom 0.152: U$8.11 101.56,14.82 103.23,13.16 103.23,10.92 96.85,4.55 JP4.3
COL4
  Bottom 0.152: U$11.3 107.79,19.17 106.7,19.17 105.89,18.37 105.89,11.91 99.39,5.41 JP4.4
COL5
  Bottom 0.152: U$11.14 113.76,19.4 114.87,19.4 116.26,18.02 116.26,13.36 112.65,9.75 104.75,9.75 101.93,6.93 JP4.5
COL6
  Bottom 0.152: U$11.11 114.81,21.34 117.78,18.36 117.78,11.79 114.68,8.69 107.8,8.69 104.47,5.36 JP4.6
COL7
  Bottom 0.152: U$12.3 121.62,15.51 119.85,15.51 119.1,14.77 119.1,10.11 116.66,7.67 109.32,7.67 107.01,5.36 JP4.7
COL8
  Bottom 0.152: JP4.8 109.55,4.65 111.68,6.78 118.89,6.78 118.89,6.76 123.62,11.5 123.62,14.58 124.54,15.49 127.37,15.49 U$12.14
COL9  (via drill 0.35)
  Top 0.152: v126.03,17.45 125.32,16.74 125.32,7.59 121.92,4.19 JP4.9
  Bottom 0.152: U$12.11 v126.04,17.45 v126.03,17.45
COLOUT_1  (via drill 0.35)
  Top 0.152: U$1.51 103.53,55.51 103.52,55.52 104.69,56.69 106.19,56.69 113.6,49.27 113.6,44.08 96.55,27.03 v96.55,12.19
  Bottom 0.152: U$8.1 95.92,11.57 v96.55,12.19
COLOUT_2  (via drill 0.35)
  Top 0.152: U$1.52 103.03,55.56 104.56,57.1 106.61,57.1 114.29,49.41 114.29,27.78 107.52,21.01 101.32,21.01 98.3,17.98 v98.3,12.32
  Bottom 0.152: U$8.16 99.25,11.57 98.5,12.32 v98.3,12.32
COLOUT_3  (via drill 0.35)
  Top 0.152: U$1.53 102.53,55.62 104.43,57.53 107,57.53 115.13,49.4 115.13,26.33 104.88,16.08 v103.76,16.08
  Bottom 0.152: v103.76,16.08 103.72,16.12 U$8.9
COLOUT_4  (via drill 0.35)
  Top 0.152: U$1.54 102.03,55.79 102.02,55.8 104.23,58.01 107.31,58.01 115.92,49.4 115.92,24.32 v109.68,18.09
  Bottom 0.152: U$11.1 v109.68,18.09
COLOUT_5  (via drill 0.35)
  Top 0.152: U$1.57 100.53,55.59 100.52,55.6 103.34,58.42 107.61,58.42 117.04,48.98 117.04,19.48 v115.47,17.91
  Bottom 0.152: v115.47,17.91 115.29,18.09 U$11.16
COLOUT_6  (via drill 0.35)
  Top 0.152: U$1.58 100.03,55.79 103.09,58.85 108.09,58.85 117.88,49.06 v117.88,25.35
  Bottom 0.152: v117.88,25.35 117.88,23.27 117.25,22.64 U$11.9
COLOUT_7  (via drill 0.35)
  Top 0.152: U$1.59 99.53,55.77 102.99,59.23 108.55,59.23 120.04,47.74 v120.04,14.2
  Bottom 0.152: U$12.1 v120.04,14.2
COLOUT_8  (via drill 0.35)
  Top 0.152: U$1.61 98.53,56.52 101.69,59.69 108.83,59.69 121.06,47.46 121.06,22.43 124.61,18.87 v124.61,14.71
  Bottom 0.152: v124.61,14.71 125.22,14.1 127.27,14.1 U$12.16
COLOUT_9  (via drill 0.35)
  Top 0.152: v125.91,18.75 121.69,22.96 121.69,47.69 109.29,60.09 101.46,60.09 98.03,56.66 U$1.62
  Bottom 0.152: U$12.9 v125.91,18.75
CSB  (via drill 0.35)
  Top 0.152: U$1.40 104.95,48.57 v100.43,53.09
  Bottom 0.152: v100.43,53.09 86.56,66.95 75.84,66.95 74.24,65.35 J1.12
FB1
  Bottom 0.152: U$9.13 U$9.14
FB2
  Bottom 0.152: U$2.13 U$2.14
FB3
  Bottom 0.152: U$10.13 U$10.14
GND  (via drill 0.35, 0.8)
  other vias: 100.73,49.25 28.47,21.69 101.88,18.57 106.65,54.74
  pour Top (isolate 0.127, rank 3): 0.23,75.72 139.45,75.72 139.45,0.18 0.23,0.18
  pour Bottom (isolate 0.254, rank 2): 0.3,76.15 138.76,76.15 138.76,-1.24 0.3,-1.24
  cutout Top: 83.83,58.75 89.4,58.75 89.4,46.43 83.3,46.43 83.3,58.8 83.83,58.8
  cutout Bottom: 83.4,58.72 89.47,58.72 89.47,46.45 83.4,46.45
MISO  (via drill 0.35)
  Top 0.152: U$1.10 93.82,48.07 90.53,44.78 53.98,44.78 v48.49,50.27
  Bottom 0.152: v48.49,50.27 41.48,57.27 JP5.5
MOSI  (via drill 0.35)
  Top 0.152: U$1.11 94.18,47.57 v94,47.39 90.68,44.07 50.62,44.07 46,48.69 v45.85,48.69 | v38.81,55.93 38.81,57.68 36.69,59.81 JP5.6
  Bottom 0.152: v94,47.39 91.97,47.39 90.02,45.44 83.08,45.44 78.97,49.56 78.97,64.9 J1.14 | v45.85,48.69 38.81,55.73 v38.81,55.93
N$1
  Top 0.152: U$1.5 93.33,50.57 88.95,54.95 X1.1
  Bottom 0.152: X1.1 C12.2
N$2
  Top 0.152: U$1.6 93.35,50.07 91.15,47.88 88.55,47.88 X1.2
  Bottom 0.152: X1.2 82.53,50.13 C13.1
N$3
  pour Top (isolate 0.406): 20.29,41.78 20.29,36.83 22.17,36.83 22.17,28.93 21.13,28.93 21.13,24.54 19.94,24.54 19.94,34.49 16.87,34.49 16.87,41.78
N$4  (via drill 0.35)
  Top 0.152: v110.45,51.38 110.14,51.07 U$1.45
  Bottom 0.152: R10.1 117.29,58.77 110.45,51.93 v110.45,51.38
N$5
  Bottom 0.152: R10.2 117.29,63.75 D1.+
N$6  (via drill 0.35)
  Top 0.152: v111.06,50.57 U$1.44
  Bottom 0.152: v111.06,50.57 120.04,59.54 R11.1
N$7
  Bottom 0.152: D2.+ 120.04,63.71 R11.2
N$9  (via drill 0.35)
  Top 0.152: U$1.60 99.04,56.17 v99.24,56.37 v99.24,56.38
  Bottom 0.152: v99.24,56.38 97.38,58.23 R13.2
NRST  (via drill 0.35)
  Top 0.152: U$1.7 95.82,49.57 v96.23,49.98 | JP2.5 93.02,69.7 88.82,69.7 C14.1 85.82,69.74 R12.1 85.77,72.51 S1.2 | v95.1,56.62 v95.1,66.57
  Bottom 0.152: v96.23,49.98 96.23,53.95 95.1,55.08 v95.1,56.62 | v95.1,66.57 95.1,71.77 JP2.5
ROW1
  Bottom 0.152: JP3.1 42.32,5.43 42.32,23.78 R3.1 C23.2 38.88,24.42 38.35,24.94 38.35,27.46 40.35,29.46 U$2.2
ROW2
  Bottom 0.152: JP3.2 44.86,5.44 44.86,29.62 43.13,31.34 39.19,31.34 C22.2 36.09,34.56 R2.1 38.86,34.54 U$2.6
ROW3
  Bottom 0.152: U$2.9 48.21,34.54 49.63,33.12 R1.1 | R1.1 53.68,33.13 C21.2 | JP3.3 50.57,6.93 R1.1
ROW4
  Bottom 0.152: JP3.4 53.92,7.75 53.92,12.62 56.61,15.31 R6.1 58.91,17.61 C17.2 58.85,17.55 60.15,17.55 61.57,18.97 61.57,21.72 60.06,23.23 U$9.2
ROW5  (via drill 0.35)
  Top 0.152: v53.39,14.48 56.46,11.4 56.46,7.75 JP3.5
  Bottom 0.152: U$9.6 57.77,28.3 57.39,27.92 R5.1 52.54,27.92 C16.2 52.52,15.35 v53.39,14.48
ROW6
  Bottom 0.152: U$9.9 65.62,28.3 66.04,27.89 R4.1 70.06,27.89 C15.2 70.11,23.55 59,12.45 59,7.75 JP3.6
ROW7  (via drill 0.35)
  Top 0.152: v71.12,5.92 71.12,3.61 69.22,1.7 61.29,1.7 JP3.7
  Bottom 0.152: U$10.2 77.31,13.14 78.08,12.37 78.08,10.24 76,8.15 75.99,8.16 C20.2 72.51,8.16 R9.1 72.48,7.25 71.14,5.92 v71.12,5.92
ROW8
  Bottom 0.152: U$10.6 73.27,18.22 R8.1 72.98,17.93 C19.2 69.83,15.6 60.94,6.71 JP3.8
ROW9
  Bottom 0.152: U$10.9 84.6,18.22 R7.1 87.39,17.95 C18.2 87.41,13.17 78.82,4.57 63.5,4.57 JP3.9
ROWOUT_1  (via drill 0.35)
  Top 0.152: U$1.15 95.59,45.57 95.9,45.26 95.9,44.73 88.39,37.21 46.53,37.21 44.48,35.15 44.48,27.81 43.1,26.44 v43.1,26.16
  Bottom 0.152: U$2.1 40.53,28.19 39.45,27.1 39.48,27.07 C23.1 R3.2 41.69,26.16 v43.1,26.16
ROWOUT_2  (via drill 0.35)
  Top 0.152: v39.19,39.37 42.24,42.42 91.57,42.42 94.22,45.07 U$1.16
  Bottom 0.152: U$2.7 41.67,35.86 40.61,35.86 40.21,36.27 R2.2 38.77,36.2 C22.1 v39.19,39.37
ROWOUT_3  (via drill 0.35)
  Top 0.152: v59.13,35.03 60.58,36.47 92.35,36.47 97,41.12 97,43.05 U$1.17
  Bottom 0.152: U$2.8 48.72,35.81 49.71,34.82 R1.2 53.68,34.83 C21.1 58.91,34.8 v59.13,35.03
ROWOUT_4  (via drill 0.35)
  Top 0.152: v53.9,25.53 53.9,29.31 56.49,31.9 91.52,31.9 98.55,38.94 98.55,43.05 U$1.20
  Bottom 0.152: U$9.1 58.15,21.95 56.61,20.42 R6.2 | R6.2 58.91,19.31 C17.1 | R6.2 53.9,22.03 v53.9,25.53
ROWOUT_5  (via drill 0.35)
  Top 0.152: v60.1,30.94 60.58,31.42 91.87,31.42 99.03,38.58 U$1.21
  Bottom 0.152: C16.1 52.54,29.62 R5.2 59.21,29.62 U$9.7 59.26,30.1 v60.1,30.94
ROWOUT_6  (via drill 0.35)
  Top 0.152: v73.25,29.49 74.14,29.49 75.49,30.84 92.18,30.84 99.53,38.19 U$1.22
  Bottom 0.152: U$9.8 67.34,29.57 R4.2 70.06,29.59 C15.1 73.2,29.54 v73.25,29.49
ROWOUT_7  (via drill 0.35)
  Top 0.152: v73.99,12.47 74.69,13.17 74.69,22.34 77.55,25.2 87.76,25.2 100.03,37.47 U$1.23
  Bottom 0.152: C20.1 | U$10.1 75.19,11.87 74.62,11.3 C20.1 | C20.1 74.6,9.84 R9.2 72.51,9.86 72.51,10.99 v73.99,12.47
ROWOUT_8  (via drill 0.35)
  Top 0.152: v77.17,21.61 86.56,21.61 101.53,36.58 U$1.26
  Bottom 0.152: U$10.7 76.08,19.65 R8.2 69.85,19.65 C19.1 71.81,21.61 v77.17,21.61
ROWOUT_9  (via drill 0.35)
  Top 0.152: v89.51,22.68 89.59,22.68 102.03,35.12 U$1.27
  Bottom 0.152: U$10.8 84.72,19.49 R7.2 87.39,19.64 C18.1 87.41,20.58 v89.51,22.68
RS  (via drill 0.35)
  Top 0.152: U$1.39 105.59,48.07 104.81,47.29 99.1,47.29 92.91,41.1 v92.91,40.88
  Bottom 0.152: v92.91,40.88 80.16,40.88 78.89,42.14 78.89,44.98 63.4,60.48 56.01,60.48 53.92,62.56 J1.4
RX_ESP  (via drill 0.35)
  Top 0.152: v110.67,49.02 109.62,50.07 U$1.43
  Bottom 0.152: v110.67,49.02 114.88,53.24 122.43,53.24 123.29,54.1 123.29,67.41 121.56,69.14 121.56,71.69 J4.8
SCLK  (via drill 0.35)
  Top 0.152: v102.97,41.86 103.02,41.91 U$1.29
  Bottom 0.152: v102.97,41.86 80.77,41.86 80.09,42.55 80.09,46.84 76.83,50.09 76.83,65.2 J1.13
SDA  (via drill 0.35)
  Top 0.152: U$1.37 105.28,47.07 104.92,46.71 99.18,46.71 94.92,42.45 94.92,40.62 93.75,39.45 v93.52,39.45
  Bottom 0.152: v93.52,39.45 59.77,39.45 57.71,41.5 57.71,55.07 52.4,60.38 37.87,60.38 33.36,64.89 JP5.8
SW_CLK  (via drill 0.35)
  Top 0.152: U$1.49 104.53,55.63 v104.51,55.65
  Bottom 0.152: JP2.2 104.51,71.33 v104.51,55.65
SWDIO  (via drill 0.35)
  Top 0.152: v107.71,52.02 107.27,51.57 U$1.46
  Bottom 0.152: v107.71,52.02 107.71,72.98 105.99,74.7 100.57,74.7 JP2.4
SWO  (via drill 0.35)
  Top 0.152: U$1.55 101.52,54.58 101.52,55.53 v101.42,55.63
  Bottom 0.152: JP2.6 95.16,74.37 96.77,74.37 97.26,73.89 97.26,68.43 99.34,66.34 99.34,58.42 101.42,56.34 v101.42,55.63
TX_ESP  (via drill 0.35)
  Top 0.152: U$1.42 107.5,49.57 v108.53,48.54
  Bottom 0.152: v108.53,48.54 108.53,53.8 115.16,60.42 J4.1

### Text on the board
tPlace: SWO NRST DIO GND CLK 3V3 | Main Board v1 / ECE477 GRP15 / Cynthia Zatlokowicz / Mechor De La Garza | +5V | GND
bPlace: 3V3 CLK GND DIO NRST SWO | PA12 | PA11 | SELECT | UP | DOWN | +5V | GND
tNames: ROWS | COLUMNS | 1 / 2 / 3 / 4 / 5 / 6 / 7 / 8 / 9 | 1 / 2 / 3 / 4 / 5 / 6 / 7 / 8 / 9
bNames: 1 / 2 / 3 / 4 / 5 / 6 / 7 / 8 / 9 | 1 / 2 / 3 / 4 / 5 / 6 / 7 / 8 / 9 | ROWS | COLUMNS